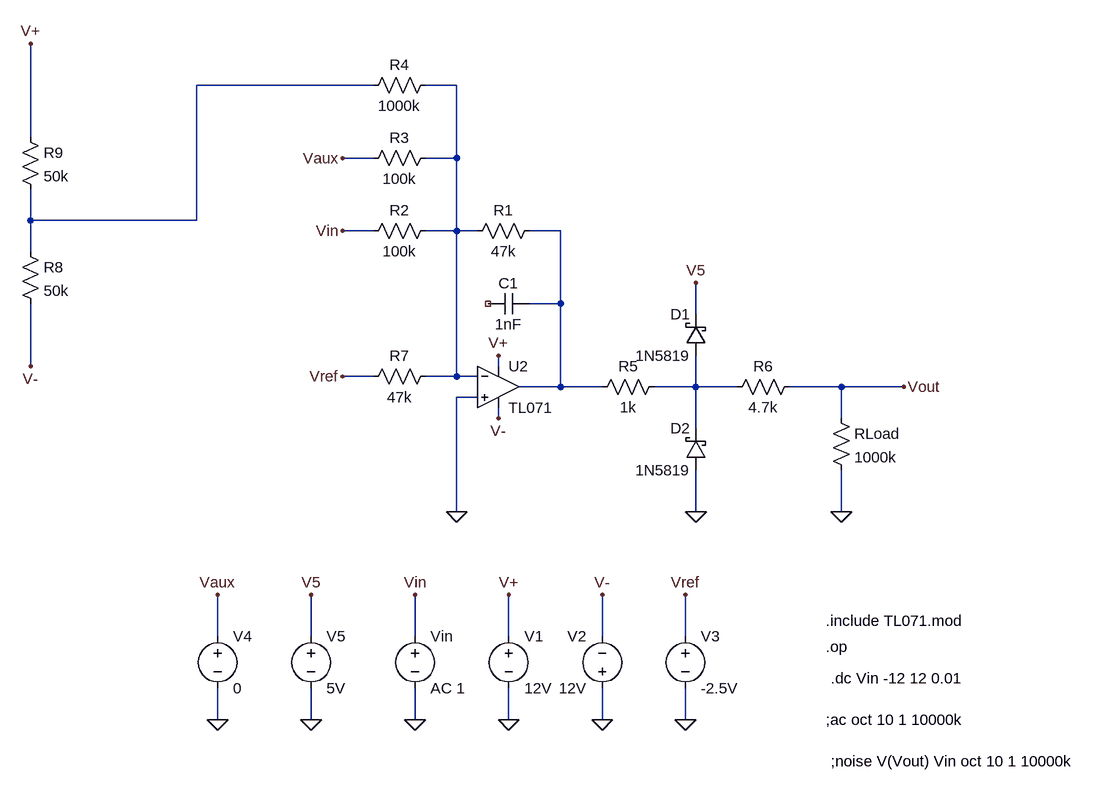
[diagram p0: schematic Attenuator.asc]
Attenuator.asc, the LTspice schematic file:
Version 4
SHEET 1 1144 1588
WIRE -512 -32 -784 -32
WIRE -384 -32 -432 -32
WIRE -1040 48 -1040 -96
WIRE -512 80 -560 80
WIRE -384 80 -384 -32
WIRE -384 80 -432 80
WIRE -1040 176 -1040 128
WIRE -784 176 -784 -32
WIRE -784 176 -1040 176
WIRE -512 192 -560 192
WIRE -384 192 -384 80
WIRE -384 192 -432 192
WIRE -352 192 -384 192
WIRE -224 192 -272 192
WIRE -1040 224 -1040 176
WIRE -224 304 -224 192
WIRE -224 304 -272 304
WIRE -16 320 -16 272
WIRE -1040 400 -1040 304
WIRE -320 400 -320 384
WIRE -512 416 -560 416
WIRE -384 416 -384 192
WIRE -384 416 -432 416
WIRE -352 416 -384 416
WIRE -224 432 -224 304
WIRE -224 432 -288 432
WIRE -160 432 -224 432
WIRE -16 432 -16 384
WIRE -16 432 -80 432
WIRE 48 432 -16 432
WIRE 208 432 128 432
WIRE 304 432 208 432
WIRE -352 448 -384 448
WIRE -320 480 -320 464
WIRE 208 480 208 432
WIRE -16 496 -16 432
WIRE -384 624 -384 448
WIRE -16 624 -16 560
WIRE 208 624 208 560
WIRE -752 816 -752 752
WIRE -608 816 -608 752
WIRE -448 816 -448 752
WIRE -304 816 -304 752
WIRE -160 816 -160 752
WIRE -32 816 -32 752
WIRE -752 944 -752 896
WIRE -608 944 -608 896
WIRE -448 944 -448 896
WIRE -304 944 -304 896
WIRE -160 944 -160 896
WIRE -32 944 -32 896
FLAG -304 944 0
FLAG -160 944 0
FLAG -304 752 V+
FLAG -320 384 V+
FLAG -160 752 V-
FLAG -320 480 V-
FLAG -32 944 0
FLAG -32 752 Vref
FLAG -560 416 Vref
FLAG 304 432 Vout
FLAG -448 944 0
FLAG -448 752 Vin
FLAG -16 624 0
FLAG -608 944 0
FLAG -608 752 V5
FLAG -16 272 V5
FLAG 208 624 0
FLAG -560 192 Vin
FLAG -560 80 Vaux
FLAG -752 944 0
FLAG -752 752 Vaux
FLAG -384 624 0
FLAG -1040 -96 V+
FLAG -1040 400 V-
SYMBOL voltage -304 800 R0
SYMATTR InstName V1
SYMATTR Value 12V
SYMBOL voltage -160 912 R180
WINDOW 0 24 96 Left 2
WINDOW 3 24 16 Left 2
SYMATTR InstName V2
SYMATTR Value 12V
SYMBOL Opamps\\opamp2 -320 368 R0
SYMATTR InstName U2
SYMATTR Value TL071
SYMBOL voltage -32 800 R0
SYMATTR InstName V3
SYMATTR Value -2.5V
SYMBOL res -256 176 R90
WINDOW 0 0 56 VBottom 2
WINDOW 3 32 56 VTop 2
SYMATTR InstName R1
SYMATTR Value 47k
SYMBOL res -416 176 R90
WINDOW 0 0 56 VBottom 2
WINDOW 3 32 56 VTop 2
SYMATTR InstName R2
SYMATTR Value 100k
SYMBOL voltage -448 800 R0
WINDOW 123 0 0 Left 2
WINDOW 39 0 0 Left 2
SYMATTR InstName Vin
SYMATTR Value AC 1
SYMBOL schottky 0 384 R180
WINDOW 0 24 64 Left 2
WINDOW 3 24 0 Left 2
SYMATTR InstName D1
SYMATTR Value 1N5819
SYMBOL schottky 0 560 R180
WINDOW 0 24 64 Left 2
WINDOW 3 24 0 Left 2
SYMATTR InstName D2
SYMATTR Value 1N5819
SYMBOL res -64 416 R90
WINDOW 0 0 56 VBottom 2
WINDOW 3 32 56 VTop 2
SYMATTR InstName R5
SYMATTR Value 1k
SYMBOL res 144 416 R90
WINDOW 0 0 56 VBottom 2
WINDOW 3 32 56 VTop 2
SYMATTR InstName R6
SYMATTR Value 4.7k
SYMBOL res 192 464 R0
SYMATTR InstName RLoad
SYMATTR Value 1000k
SYMBOL voltage -608 800 R0
SYMATTR InstName V5
SYMATTR Value 5V
SYMBOL cap -272 288 R90
WINDOW 0 0 32 VBottom 2
WINDOW 3 32 32 VTop 2
SYMATTR InstName C1
SYMATTR Value 1nF
SYMBOL res -416 64 R90
WINDOW 0 0 56 VBottom 2
WINDOW 3 32 56 VTop 2
SYMATTR InstName R3
SYMATTR Value 100k
SYMBOL res -416 -48 R90
WINDOW 0 0 56 VBottom 2
WINDOW 3 32 56 VTop 2
SYMATTR InstName R4
SYMATTR Value 1000k
SYMBOL voltage -752 800 R0
SYMATTR InstName V4
SYMATTR Value 0
SYMBOL res -416 400 R90
WINDOW 0 0 56 VBottom 2
WINDOW 3 32 56 VTop 2
SYMATTR InstName R7
SYMATTR Value 47k
SYMBOL res -1056 208 R0
SYMATTR InstName R8
SYMATTR Value 50k
SYMBOL res -1056 32 R0
SYMATTR InstName R9
SYMATTR Value 50k
TEXT 184 792 Left 2 !.include TL071.mod
TEXT 184 832 Left 2 !.op
TEXT 192 880 Left 2 !.dc Vin -12 12 0.01
TEXT 184 944 Left 2 !;ac oct 10 1 10000k
TEXT 192 1008 Left 2 !;noise V(Vout) Vin oct 10 1 10000k

The netlist it stands for:
* Attenuator.asc
V1 V+ 0 12V
V2 0 V- 12V
XU2 0 N002 V+ V- N003 TL071  ; pins In+ In- V+ V- OUT
V3 Vref 0 -2.5V
R1 N003 N002 47k
R2 N002 Vin 100k
Vin Vin 0 AC 1
D1 N004 V5 1N5819
D2 0 N004 1N5819
R5 N004 N003 1k
R6 Vout N004 4.7k
RLoad Vout 0 1000k
V5 V5 0 5V
C1 N003 NC_01 1nF
R3 N002 Vaux 100k
R4 N002 N001 1000k
V4 Vaux 0 0
R7 N002 Vref 47k
R8 N001 V- 50k
R9 V+ N001 50k
.model D D
.lib standard.dio
.include TL071.mod
.op
.dc Vin -12 12 0.01
;ac oct 10 1 10000k
;noise V(Vout) Vin oct 10 1 10000k
.backanno
.end